# Altium project narwhal_1.PrjPcb
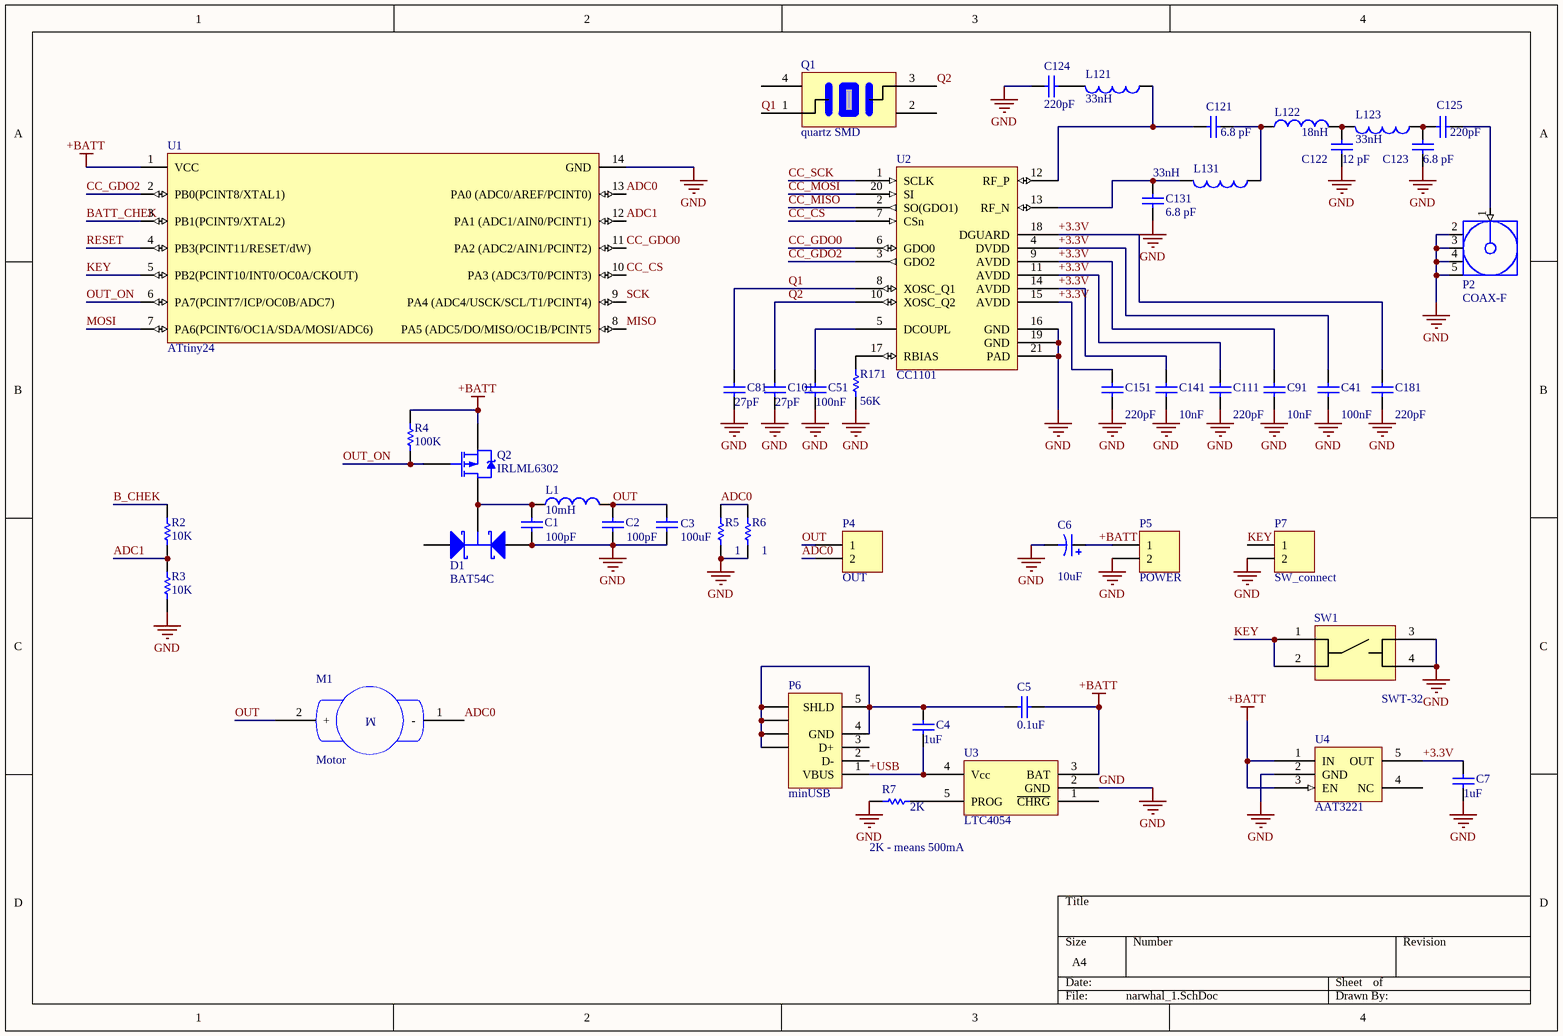
[diagram p0: narwhal_1.SchDoc]
1 sheet, 48 parts. Net scope: global (net labels, ports and power ports of the same name join across sheets).

## Sheet narwhal_1.SchDoc
size A4

### Parts
C1  100pF  [1608[0603]A]
C2  100pF  [2012[0805]A]
C3  100uF  [1608[0603]]
C4  value 1uF  [CAPC1608L]  (hidden comment: Cap Semi)
C5  value 0.1uF  [CAPC1005L]  (hidden comment: Cap Semi)
C6  value 10uF  [CAPC2012L]  (hidden comment: Cap Pol3)
C7  value 1uF  [CAPC1608L]  (hidden comment: Cap Semi)
C41  value 100nF  [CAPC1005L]  (hidden comment: Cap Semi)
C51  value 100nF  [CAPC1005L]  (hidden comment: Cap Semi)
C81  value 27pF  [CAPC1005L]  (hidden comment: Cap Semi)
C91  value 10nF  [CAPC1005L]  (hidden comment: Cap Semi)
C101  value 27pF  [CAPC1005L]  (hidden comment: Cap Semi)
C111  value 220pF  [CAPC1005L]  (hidden comment: Cap Semi)
C121  value 6.8 pF  [CAPC1005L]  (hidden comment: Cap Semi)
C122  value 12 pF  [CAPC1005L]  (hidden comment: Cap Semi)
C123  value 6.8 pF  [CAPC1005L]  (hidden comment: Cap Semi)
C124  value 220pF  [CAPC1005L]  (hidden comment: Cap Semi)
C125  value 220pF  [CAPC1005L]  (hidden comment: Cap Semi)
C131  value 6.8 pF  [CAPC1005L]  (hidden comment: Cap Semi)
C141  value 10nF  [CAPC1005L]  (hidden comment: Cap Semi)
C151  value 220pF  [CAPC1005L]  (hidden comment: Cap Semi)
C181  value 220pF  [CAPC1005L]  (hidden comment: Cap Semi)
D1  BAT54C  [SOT23_N]
L1  value 10mH  [6332[2512]]  (hidden comment: Inductor)
L121  value 33nH  [INDC1005AL]  (hidden comment: Inductor)
L122  value 18nH  [INDC1005AL]  (hidden comment: Inductor)
L123  value 33nH  [INDC1005AL]  (hidden comment: Inductor)
L131  value 33nH  [INDC1005AL]  (hidden comment: Inductor)
M1  Motor  [Motor]
P2  COAX-F  [MCX5.08-H5]
P4  OUT  [HDR1X2H]
P5  POWER  [HDR1X2H]
P6  minUSB  [440479]
P7  SW_connect  [HDR1X2]
Q1  quartz SMD  [quartz_pattern]
Q2  IRLML6302  [SOT-23]
R2  value 10K  [RESC1005L]  (hidden comment: Res Semi)
R3  value 10K  [RESC1005L]  (hidden comment: Res Semi)
R4  value 100K  [RESC1005L]  (hidden comment: Res Semi)
R5  1  [1608[0603]A]
R6  1  [1608[0603]A]
R7  value 2K  [RESC1005L]  (hidden comment: Res Semi)
R171  value 56K  [RESC1005L]  (hidden comment: Res Semi)
SW1  SWT-32  [SWT-32 pattern]
U1  ATtiny24  [SOIC14_M]
U2  CC1101  [QFN50P397X397X80-20N]
U3  LTC4054  [SOT95P270X100-5N]
U4  AAT3221  [SOT95P280X145-5N]

### Nets
+BATT: C5.2 C6.1 P5.1 Q2.2(S) R4.1 U1.1(VCC) U3.3(BAT) U4.1(IN) U4.3(EN)
GND: C1.1 C2.1 C3.1 C6.2 C7.2 C41.1 C51.1 C81.1 C91.1 C101.1 C111.1 C122.1 C123.1 C124.2 C131.2 C141.1 C151.1 C181.1 D1.2(A2) P2.2(GND) P2.3(GND) P2.4(GND) P2.5(GND) P5.2 P7.2 R3.2 R5.1 R6.1 R7.2 R171.1 SW1.3 SW1.4 U1.14(GND) U2.16(GND) U2.19(GND) U2.21(PAD) U3.2(GND) U4.2(GND)
+3.3V: C7.1 C41.2 C91.2 C111.2 C141.2 C151.2 C181.2 U2.4(DVDD) U2.9(AVDD) U2.11(AVDD) U2.14(AVDD) U2.15(AVDD) U2.18(DGUARD) U4.5(OUT)
+USB: C4.2 P6.1(VBUS) U3.4(Vcc)
ADC0: M1.1(-) P4.2 R5.2 R6.2 U1.13(PA0_(ADC0/AREF/PCINT0))
ADC1: R2.2 R3.1 U1.12(PA1_(ADC1/AIN0/PCINT1))
B_CHEK: R2.1
BATT_CHEK: U1.3(PB1(PCINT9/XTAL2))
CC_CS: U1.10(PA3_(ADC3/T0/PCINT3)) U2.7(CSn)
CC_GDO0: U1.11(PA2_(ADC2/AIN1/PCINT2)) U2.6(GDO0)
CC_GDO2: U1.2(PB0(PCINT8/XTAL1)) U2.3(GDO2)
CC_MISO: U2.2(SO(GDO1))
CC_MOSI: U2.20(SI)
CC_SCK: U2.1(SCLK)
KEY: P7.1 SW1.1 SW1.2 U1.5(PB2(PCINT10/INT0/OC0A/CKOUT))
MISO: U1.8(PA5_(ADC5/DO/MISO/OC1B/PCINT5)
MOSI: U1.7(PA6(PCINT6/OC1A/SDA/MOSI/ADC6))
OUT: C2.2 C3.2 L1.2 M1.2(+) P4.1
OUT_ON: Q2.1(G) R4.2 U1.6(PA7(PCINT7/ICP/OC0B/ADC7))
Q1: C81.2 Q1.1 U2.8(XOSC_Q1)
Q2: C101.2 Q1.3 U2.10(XOSC_Q2)
RESET: U1.4(PB3(PCINT11/RESET/dW))
SCK: U1.9(PA4_(ADC4/USCK/SCL/T1/PCINT4))
NetC1_2: C1.2 D1.3(K) L1.1 Q2.3(D)
NetC4_1: C4.1 C5.1 P6.4(GND) P6.5(SHLD) P6.6(SHLD) P6.7(SHLD) P6.8(SHLD) P6.9(SHLD)
NetC51_2: C51.2 U2.5(DCOUPL)
NetC121_1: C121.1 L122.1 L131.1
NetC121_2: C121.2 L121.1 U2.12(RF_P)
NetC122_2: C122.2 L122.2 L123.2
NetC123_2: C123.2 C125.2 L123.1
NetC124_1: C124.1 L121.2
NetC125_1: C125.1 P2.1(Signal)
NetC131_1: C131.1 L131.2 U2.13(RF_N)
NetR7_1: R7.1 U3.5(PROG)
NetR171_2: R171.2 U2.17(RBIAS)

Not connected (* = marked no-connect by the designer): D1 1(A1); P6 2(D-) 3(D+); Q1 2 4; U3 1(~{CHRG}); U4 4(NC)

### Notes on the sheet
- 2K - means 500mA
- (in symbol Motor) M

### Library data of the parts
C1-C5 C7 C41 C51 C81 C91 C101 C111 C121-C125 C131 C141 C151 C181 = Cap Semi: Capacitor (Semiconductor SIM Model); Published: 8-Jun-2000; PackageReference: C1206; Publisher: Altium Limited
  C1 C2: LatestRevisionDate: 17-Jul-2002; LatestRevisionNote: Re-released for DXP Platform.; Value: 100pF
  C3: LatestRevisionDate: 17-Jul-2002; LatestRevisionNote: Re-released for DXP Platform.; Value: 100uF
  C4 C5 C7 C41 C51 C81 C91 C101 C111 C121-C125 C131 C141 C151 C181: LatestRevisionDate: 29-May-2009; LatestRevisionNote: IPC-7351 Footprint Added.; PackageDescription: Chip Capacitor
C6 = Cap Pol3: Polarized Capacitor (Surface Mount); Published: 8-Jun-2000; LatestRevisionDate: 29-May-2009; LatestRevisionNote: IPC-7351 Footprint Added.; PackageReference: C0805; Publisher: Altium Limited; PackageDescription: Chip Capacitor
D1 = BAT54C: Schottky Barrier Double Diode; Published: 17-Sep-2003; LatestRevisionDate: 12-Dec-2006; LatestRevisionNote: IPC-7351 Footprint Added.; DatasheetVersion: 4-Mar-2002; PackageVersion: May-1999; PackageReference: SOT23; Publisher: Altium Limited; PackageDescription: 3-Pin SOT-23 Package 0.95 mm Pitch, 2.3 mm Lead Span; ComponentLink1Description: Manufacturer Link; ComponentLink1URL: http://www.semiconductors.philips.com/; ComponentLink2Description: Datasheet; ComponentLink2URL: http://www.semiconductors.philips.com/acrobat/datasheets/BAT54_SERIES_4.pdf
L1 L121-L123 L131 = Inductor: Code_IEC: 1005; Published: 8-Jun-2000; PackageReference: 0402-A; Publisher: Altium Limited; Code_JEITA: 0402
  L1: LatestRevisionDate: 17-Jul-2002; LatestRevisionNote: Re-released for DXP Platform.
  L121-L123 L131: LatestRevisionDate: 29-May-2009; LatestRevisionNote: IPC-7351 Footprint Added.; PackageDescription: Chip Inductor
P2 = COAX-F: RF Coaxial PCB Connector, MCX; Thru-Hole, Right-Angle Mount Socket, Blunt Post Terminal, 50 Ohm Impedance; PCB_Layout: Complies with manufacturer's recommendation.; DrillSize: Corresponds to nominal value.; Published: 15-Jul-2004; LatestRevisionDate: 15-Jul-2004; LatestRevisionNote: Component Replaced.; DatasheetDocument: 30-May-2003; PackageDocument: 04-Jul-1999; PackageReference: 919-119J-51AX; Publisher: Altium Limited; ComponentLink1Description: Manufacturer Link; ComponentLink1URL: http://www.amphenolrf.com/
P4 P5 = Header 2H: Header, 2-Pin, Right Angle; LatestRevisionDate: 17-Jul-2002; LatestRevisionNote: Re-released for DXP Platform.; Publisher: Altium Limited
P6 = 440478-2: USB 2.0, Right Angle, SMT, A Type, Receptacle, 5 Position, Black; ContactMaterial: Phosphor Bronze; ContactPlating: Gold (30) over Nickel; PCB_Layout: Complies with manufacturer's recommendation.; DrillSize: Corresponds to nominal value.; PanelGround: Without; Published: 15-Jul-2004; DatasheetDocument: 15-Nov-2002; PackageDocument: 15-Nov-2002; PackageReference: 440478; Publisher: Altium Limited; HousingMaterial: Thermoplastic; ComponentLink1Description: Manufacturer Link; ComponentLink1URL: http://www.tycoelectronics.com/; ComponentLink2Description: Packaging Specification; ComponentLink2URL: http://ecommas.tycoelectronics.com/commerce/DocumentDelivery/DDEController?Action=showdoc&DocId=Customer+Drawing%7F440478%7FB%7Fpdf%7FEnglish%7FC_440478_B.pdf
P7 = Header 2: Header, 2-Pin; LatestRevisionDate: 17-Jul-2002; LatestRevisionNote: Re-released for DXP Platform.; Publisher: Altium Limited
Q1 = qartz 0532: в корпусе 0532
Q2 = IRLML6302: HEXFET Power MOSFET; Published: 8-Jun-2000; LatestRevisionDate: 17-Jul-2002; LatestRevisionNote: Re-released for DXP Platform.; DatasheetVersion: Aug-1997; PackageReference: SOT-23; Publisher: Altium Limited; PackageDescription: SOT-23; 3 Leads; Body 3.1 x 2.5 mm, inc. leads (LxW max); ComponentLink1Description: Manufacturer Link; ComponentLink1URL: http://www.irf.com/; ComponentLink2Description: Datasheet; ComponentLink2URL: http://www.irf.com/product-info/datasheets/data/irlml6302.pdf
R2-R7 R171 = Res Semi: Semiconductor Resistor; Published: 8-Jun-2000; LatestRevisionDate: 17-Jul-2002; LatestRevisionNote: Re-released for DXP Platform.; PackageReference: AXIAL-0.5; Publisher: Altium Limited
  R5 R6: Value: 1
SW1 = SWT-32: Кнопка тактовая, поверхностный монтаж
U1 = ATtiny24: 8-Bit AVR Microcontroller with 1K Byte of Flash Memory; Published: 17-Sep-2003; LatestRevisionDate: 13-Apr-2006; LatestRevisionNote: IPC-7351 Footprint Added.; DatasheetVersion: 1187E-AVR-06/02; PackageVersion: revB, May-2002; PackageReference: 8S2; Publisher: Altium Limited; PackageDescription: 8-Pin Small Outline Package 1.27 mm Pitch; ComponentLink1Description: Manufacturer Link; ComponentLink1URL: http://www.atmel.com; ComponentLink2Description: Datasheet; ComponentLink2URL: http://www.atmel.com/dyn/resources/prod_documents/doc1187.pdf
U2 = CC1101: Low-Power Sub-1 GHz RF Transceiver
U3 = LTC4054: Standalone Linear  Li-Ion Battery Charger with  Thermal Regulation in ThinSOT
U4 = AAT3221: PowerLinear NanoPower low   dropout (LDO) linear regulator.